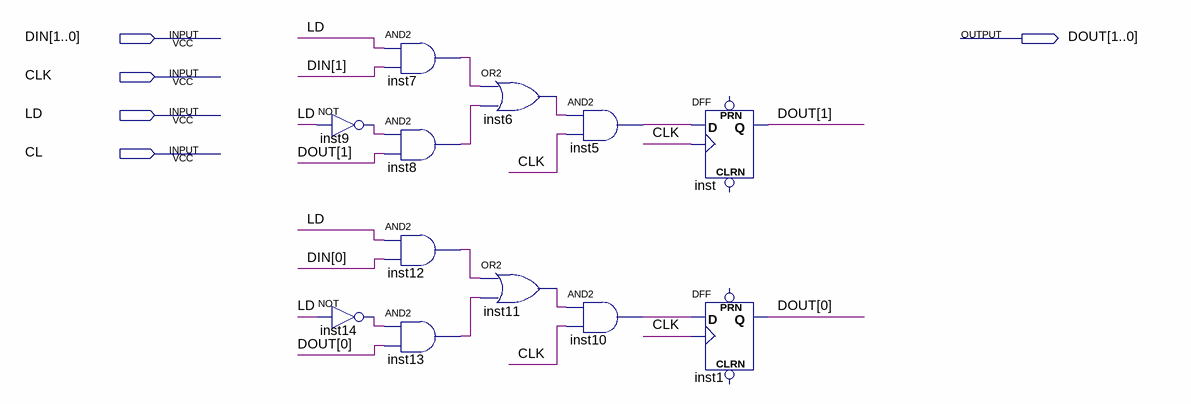
[diagram p0: schematic sheet]
// Quartus schematic REG2_LD_CL.bdf as structural Verilog: 12 symbols, 5 pins
module REG2_LD_CL (
  input  [1:0] DIN,
  input  CLK,
  input  LD,
  input  CL,
  output [1:0] DOUT
);

  wire inst5_out, inst6_out, inst7_out, inst8_out, inst9_out, inst10_out, inst11_out, inst12_out, inst13_out,
       inst14_out;

  not inst9 (inst9_out, LD);
  not inst14 (inst14_out, LD);
  and inst7 (inst7_out, LD, DIN[1]);
  and inst8 (inst8_out, inst9_out, DOUT[1]);
  and inst12 (inst12_out, LD, DIN[0]);
  and inst13 (inst13_out, inst14_out, DOUT[0]);
  or inst6 (inst6_out, inst7_out, inst8_out);
  or inst11 (inst11_out, inst12_out, inst13_out);
  and inst5 (inst5_out, inst6_out, CLK);
  and inst10 (inst10_out, inst11_out, CLK);
  DFF inst (.CLK(CLK), .D(inst5_out), .Q(DOUT[1]));  // open: CLRN, PRN
  DFF inst1 (.CLK(CLK), .D(inst10_out), .Q(DOUT[0]));  // open: CLRN, PRN
endmodule
